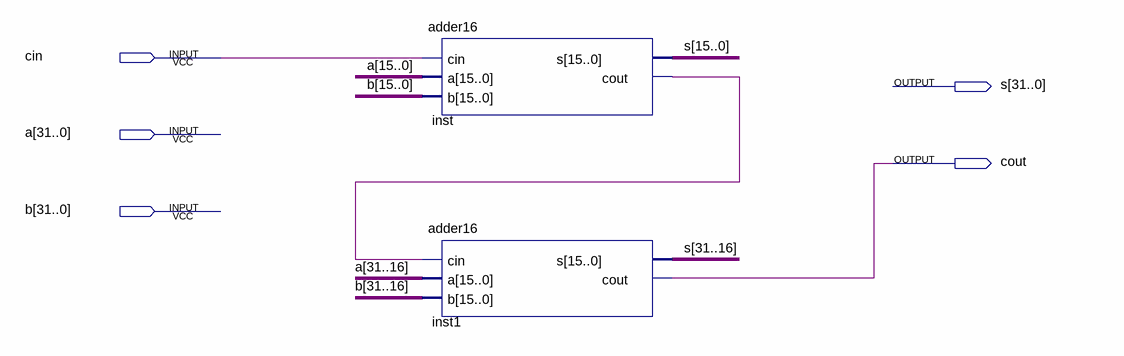
[diagram p0: schematic sheet]
// Quartus schematic adder32.bdf as structural Verilog: 2 symbols, 5 pins
module adder32 (
  input  cin,
  input  [31:0] a,
  input  [31:0] b,
  output [31:0] s,
  output cout
);

  wire inst_cout;

  adder16 inst (.cin(cin), .a(a[15:0]), .b(b[15:0]), .s(s[15:0]), .cout(inst_cout));
  adder16 inst1 (.cin(inst_cout), .a(a[31:16]), .b(b[31:16]), .s(s[31:16]), .cout(cout));
endmodule
